# EAGLE schematic trigger (EAGLE 6.5.0)
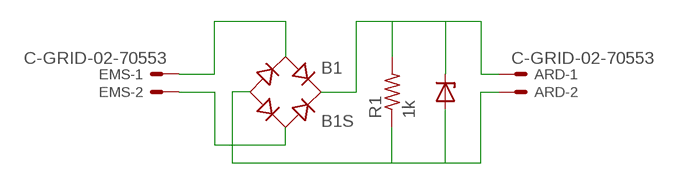
[diagram p0: schematic, sheet 1]

## Parts
ARD  C-GRID-02-70553  [70553-02]
B1  B1S  [MBS]
EMS  C-GRID-02-70553  [70553-02]
R1  1k  R-US_0207/12  [0207/12]

## Nets
N$1: B1.AC1 EMS.1
N$2: B1.AC2 EMS.2
N$3: ARD.2 B1.- R1.1
N$4: ARD.1 B1.+ R1.2

## Library data of the parts
ARD EMS = con-molex:C-GRID-02: CONNECTOR wire to board 2.54 mm (0.100") pitch header; OC_FARNELL: unknown; OC_NEWARK: unknown
B1 = rectifier:B*S: Surface Mount Glass Passivated Bridge Rectifiers Source: Comchip Bridge Rectifiers B05S-G_B10S-G.pdf
R1 = resistor:R-US_: RESISTOR, American symbol